# EAGLE design template_esp32 (EAGLE 9.6.2)

## Sheet 1 of 2
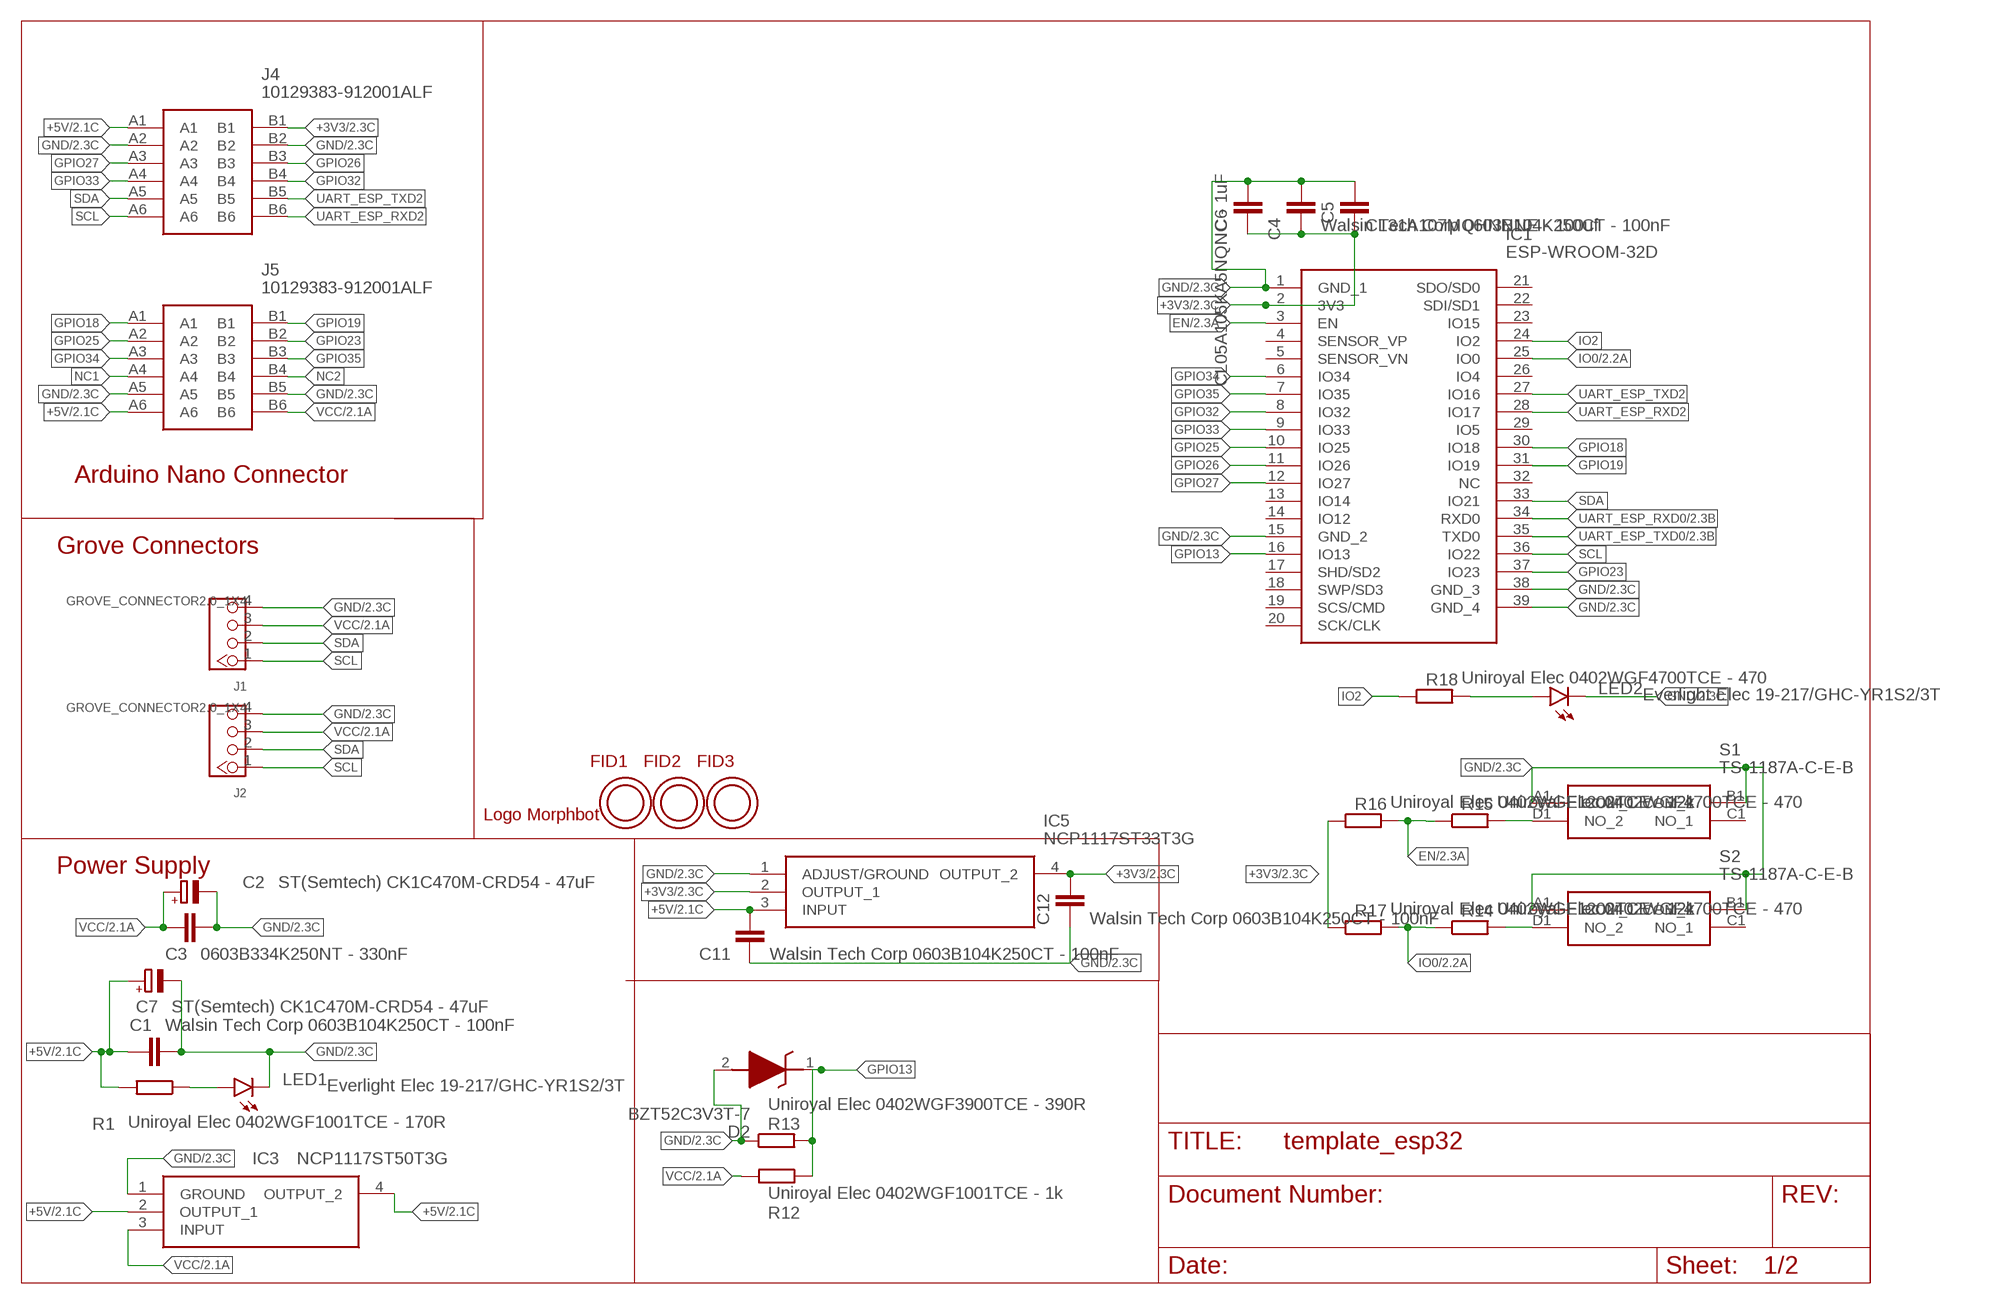
[diagram p0: schematic, sheet 1]

### Parts
C1  Walsin Tech Corp 0603B104K250CT - 100nF  C-EUC0603  [C0603]
C2  ST(Semtech) CK1C470M-CRD54 - 47uF  CPOL-EUC  [PANASONIC_C]
C3  0603B334K250NT - 330nF  C-EUC0603  [C0603]
C4  Walsin Tech Corp 0603B104K250CT - 100nF  C-EUC0603  [C0603]
C5  CL31A107MQHNNNE - 100uf  C-EUC1206  [C1206]
C6  CL05A105KA5NQNC - 1uF  C-EUC0402  [C0402]
C7  ST(Semtech) CK1C470M-CRD54 - 47uF  CPOL-EUC  [PANASONIC_C]
C11  Walsin Tech Corp 0603B104K250CT - 100nF  C-EUC0603  [C0603]
C12  Walsin Tech Corp 0603B104K250CT - 100nF  C-EUC0603  [C0603]
D2  BZT52C3V3T-7  [SODFL1608X65N]
FID1  OPEN-PNP-FIDUCIAL  [OPEN-PNP-FIDUCIAL]
FID2  OPEN-PNP-FIDUCIAL  [OPEN-PNP-FIDUCIAL]
FID3  OPEN-PNP-FIDUCIAL  [OPEN-PNP-FIDUCIAL]
IC1  ESP-WROOM-32D  [ESPWROOM32D]
IC3  NCP1117ST50T3G  [SOT230P700X180-4N]
IC5  NCP1117ST33T3G  [SOT230P700X180-4N]
J1  GROVE_CONNECTOR2.0_1X4  [2.0_1X4_STRAIGHT]
J2  GROVE_CONNECTOR2.0_1X4  [2.0_1X4_STRAIGHT]
J4  10129383-912001ALF  [10129383912001ALF]
J5  10129383-912001ALF  [10129383912001ALF]
LED1  Everlight Elec 19-217/GHC-YR1S2/3T  LEDCHIPLED_0603  [CHIPLED_0603]
LED2  Everlight Elec 19-217/GHC-YR1S2/3T  LEDCHIPLED_0603  [CHIPLED_0603]
R1  Uniroyal Elec 0402WGF1001TCE - 170R  R-EU_R0402  [R0402]
R12  Uniroyal Elec 0402WGF1001TCE - 1k  R-EU_R0402  [R0402]
R13  Uniroyal Elec 0402WGF3900TCE - 390R  R-EU_R0402  [R0402]
R14  Uniroyal Elec 0402WGF4700TCE - 470  R-EU_R0402  [R0402]
R15  Uniroyal Elec 0402WGF4700TCE - 470  R-EU_R0402  [R0402]
R16  Uniroyal Elec 0402WGF1202TCE - 12k  R-EU_R0402  [R0402]
R17  Uniroyal Elec 0402WGF1202TCE - 12k  R-EU_R0402  [R0402]
R18  Uniroyal Elec 0402WGF4700TCE - 470  R-EU_R0402  [R0402]
S1  TS-1187A-C-E-B  [TS1187ACEB]
S2  TS-1187A-C-E-B  [TS1187ACEB]
U$1  LOGO_MORPHBOT3MM  [LOGO_MOPRHBOT_3MM]

### Nets
+3V3: C4.1 C5.2 C6.1 C12.2 IC1.2(3V3) IC5.2(OUTPUT_1) IC5.4(OUTPUT_2) J4.B1 R16.1 R17.1 ; also sheet 2
+5V: C1.1 C7.+ C11.2 IC3.2(OUTPUT_1) IC3.4(OUTPUT_2) IC5.3(INPUT) J4.A1 J5.A6 R1.2 ; also sheet 2
EN: IC1.3(EN) R15.1 R16.2 ; also sheet 2
GND: C1.2 C2.- C3.1 C4.2 C5.1 C6.2 C7.- C11.1 C12.1 D2.2(A) IC1.1(GND_1) IC1.15(GND_2) IC1.38(GND_3) IC1.39(GND_4) IC3.1(GROUND) IC5.1(ADJUST/GROUND) J1.4 J2.4 J4.A2 J4.B2 J5.A5 J5.B5 LED1.C LED2.C R13.1 S1.A1(COM_1) S1.B1(COM_2) S2.A1(COM_1) S2.B1(COM_2) ; also sheet 2
GPIO13: D2.1(K) IC1.16(IO13) R12.1 R13.2
GPIO18: IC1.30(IO18) J5.A1
GPIO19: IC1.31(IO19) J5.B1
GPIO23: IC1.37(IO23) J5.B2
GPIO25: IC1.10(IO25) J5.A2
GPIO26: IC1.11(IO26) J4.B3
GPIO27: IC1.12(IO27) J4.A3
GPIO32: IC1.8(IO32) J4.B4
GPIO33: IC1.9(IO33) J4.A4
GPIO34: IC1.6(IO34) J5.A3
GPIO35: IC1.7(IO35) J5.B3
IO0: IC1.25(IO0) R14.1 R17.2 ; also sheet 2
IO2: IC1.24(IO2) R18.1
N$1: LED1.A R1.1
N$10: R15.2 S1.D1(NO_2)
N$11: R14.2 S2.D1(NO_2)
N$12: LED2.A R18.2
NC1: J5.A4
NC2: J5.B4
SCL: IC1.36(IO22) J1.1 J2.1 J4.A6
SDA: IC1.33(IO21) J1.2 J2.2 J4.A5
UART_ESP_RXD0: IC1.34(RXD0) ; also sheet 2
UART_ESP_RXD2: IC1.28(IO17) J4.B6
UART_ESP_TXD0: IC1.35(TXD0) ; also sheet 2
UART_ESP_TXD2: IC1.27(IO16) J4.B5
VCC: C2.+ C3.2 IC3.3(INPUT) J1.3 J2.3 J5.B6 R12.2 ; also sheet 2
Unconnected: IC1.4(SENSOR_VP) IC1.5(SENSOR_VN) IC1.13(IO14) IC1.14(IO12) IC1.17(SHD/SD2) IC1.18(SWP/SD3) IC1.19(SCS/CMD) IC1.20(SCK/CLK) IC1.21(SDO/SD0) IC1.22(SDI/SD1) IC1.23(IO15) IC1.26(IO4) IC1.29(IO5) IC1.32(NC) S1.C1(NO_1) S2.C1(NO_1)

### Notes on the sheet
- Arduino Nano Connector
- Grove Connectors
- Power Supply

## Sheet 2 of 2
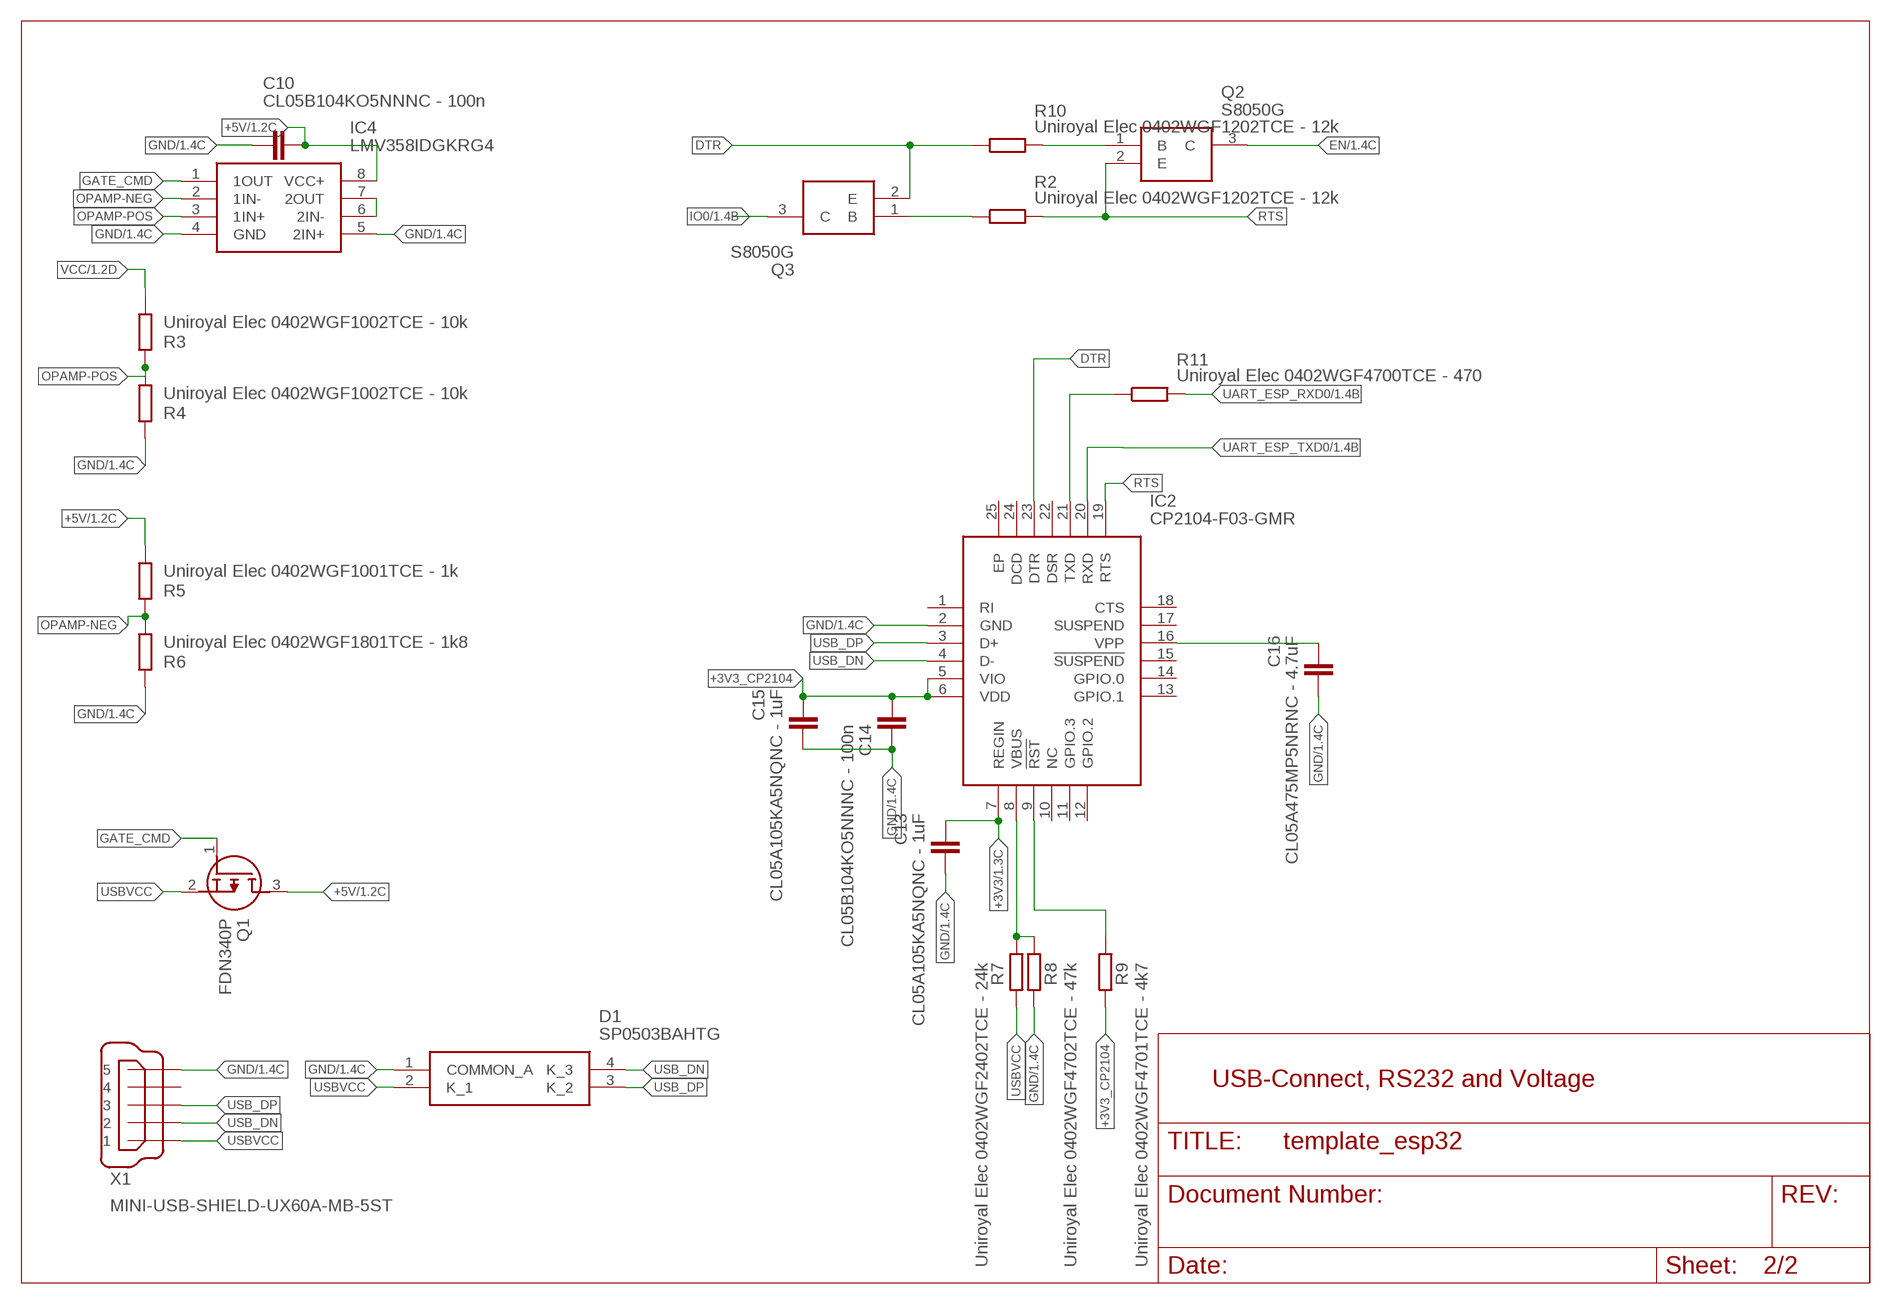
[diagram p1: schematic, sheet 2]

### Parts
C10  CL05B104KO5NNNC - 100n  C-EUC0402  [C0402]
C13  CL05A105KA5NQNC - 1uF  C-EUC0402  [C0402]
C14  CL05B104KO5NNNC - 100n  C-EUC0402  [C0402]
C15  CL05A105KA5NQNC - 1uF  C-EUC0402  [C0402]
C16  CL05A475MP5NRNC - 4.7uF  C-EUC0402  [C0402]
D1  SP0503BAHTG  [SP0503BAHTG]
IC2  CP2104-F03-GMR  [QFN50P400X400X80-25N]
IC4  LMV358IDGKRG4  [SOP65P490X110-8N]
Q1  FDN340P  [SOT95P237X112-3N]
Q2  S8050G  [SOT95P240X110-3N]
Q3  S8050G  [SOT95P240X110-3N]
R2  Uniroyal Elec 0402WGF1202TCE - 12k  R-EU_R0402  [R0402]
R3  Uniroyal Elec 0402WGF1002TCE - 10k  R-EU_R0402  [R0402]
R4  Uniroyal Elec 0402WGF1002TCE - 10k  R-EU_R0402  [R0402]
R5  Uniroyal Elec 0402WGF1001TCE - 1k  R-EU_R0402  [R0402]
R6  Uniroyal Elec 0402WGF1801TCE - 1k8  R-EU_R0402  [R0402]
R7  Uniroyal Elec 0402WGF2402TCE - 24k  R-EU_R0402  [R0402]
R8  Uniroyal Elec 0402WGF4702TCE - 47k  R-EU_R0402  [R0402]
R9  Uniroyal Elec 0402WGF4701TCE - 4k7  R-EU_R0402  [R0402]
R10  Uniroyal Elec 0402WGF1202TCE - 12k  R-EU_R0402  [R0402]
R11  Uniroyal Elec 0402WGF4700TCE - 470  R-EU_R0402  [R0402]
X1  MINI-USB-SHIELD-UX60A-MB-5ST  [UX60A-MB-5ST]

### Nets
+3V3: C13.2 IC2.7(REGIN) ; also sheet 1
+3V3_CP2104: C14.2 C15.2 IC2.5(VIO) IC2.6(VDD) R9.2
+5V: C10.2 IC4.8(VCC+) Q1.3(D) R5.1 ; also sheet 1
DTR: IC2.23(DTR) Q3.2(E) R10.1
EN: Q2.3(C) ; also sheet 1
GATE_CMD: IC4.1(1OUT) Q1.1(G)
GND: C10.1 C13.1 C14.1 C15.1 C16.1 D1.1(COMMON_A) IC2.2(GND) IC4.4(GND) IC4.5(2IN+) R4.2 R6.2 R8.2 X1.5 ; also sheet 1
IO0: Q3.3(C) ; also sheet 1
N$3: Q3.1(B) R2.1
N$4: IC4.6(2IN-) IC4.7(2OUT)
N$5: IC2.8(VBUS) R7.1 R8.1
N$6: IC2.9(!RST) R9.1
N$7: C16.2 IC2.16(VPP)
N$8: IC2.21(TXD) R11.1
N$9: Q2.1(B) R10.2
OPAMP-NEG: IC4.2(1IN-) R5.2 R6.1
OPAMP-POS: IC4.3(1IN+) R3.2 R4.1
RTS: IC2.19(RTS) Q2.2(E) R2.2
UART_ESP_RXD0: R11.2 ; also sheet 1
UART_ESP_TXD0: IC2.20(RXD) ; also sheet 1
USB_DN: D1.4(K_3) IC2.4(D-) X1.2
USB_DP: D1.3(K_2) IC2.3(D+) X1.3
USBVCC: D1.2(K_1) Q1.2(S) R7.2 X1.1
VCC: R3.1 ; also sheet 1
Unconnected: IC2.1(RI) IC2.10(NC) IC2.11(GPIO.3) IC2.12(GPIO.2) IC2.13(GPIO.1) IC2.14(GPIO.0) IC2.15(!SUSPEND) IC2.17(SUSPEND) IC2.18(CTS) IC2.22(DSR) IC2.24(DCD) IC2.25(EP) X1.4 X1.M1(S1) X1.M2(S2) X1.M3(S3) X1.M4(S4)

### Notes on the sheet
- USB-Connect, RS232 and Voltage

## Library data of the parts
C1 C3-C6 C10-C16 = rcl:C-EU: CAPACITOR, European symbol; SPICEPREFIX: C
C2 C7 = rcl:CPOL-EU: POLARIZED CAPACITOR, European symbol; SPICEPREFIX: C
D1 = samacsys:SP0503BAHTG: ESD Suppressors / TVS Diodes TVS AVAL DIODE SMT Source: Datasheet <https://nl.mouser.com/datasheet/2/240/Littelfuse_TVS_Diode_Array_SP05_Datasheet.pdf-777043.pdf>; ARROW_PART_NUMBER: SP0503BAHTG; ARROW_PRICE-STOCK: https://www.arrow.com/en/products/sp0503bahtg/littelfuse; DESCRIPTION: ESD Suppressors / TVS Diodes TVS AVAL DIODE SMT; HEIGHT: 1.22mm; MANUFACTURER_NAME: LITTELFUSE; MANUFACTURER_PART_NUMBER: SP0503BAHTG; MOUSER_PART_NUMBER: 576-SP0503BAHTG; MOUSER_PRICE-STOCK: https://www.mouser.co.uk/ProductDetail/Littelfuse/SP0503BAHTG?qs=uD%2FdkN7XIa0NTYXwHdELYA%3D%3D
D2 = samacsys:BZT52C3V3T-7: Diodes Inc BZT52C3V3T-7 Zener Diode, 3.3V 6% 300 mW SMT 2-Pin SOD-523 Source: Datasheet <http://docs-emea.rs-online.com/webdocs/1325/0900766b81325340.pdf>; ARROW_PART_NUMBER: BZT52C3V3T-7; ARROW_PRICE-STOCK: https://www.arrow.com/en/products/bzt52c3v3t-7/diodes-incorporated; DESCRIPTION: Diodes Inc BZT52C3V3T-7 Zener Diode, 3.3V 6% 300 mW SMT 2-Pin SOD-523; HEIGHT: 0.65mm; MANUFACTURER_NAME: Diodes Inc.; MANUFACTURER_PART_NUMBER: BZT52C3V3T-7; MOUSER_PART_NUMBER: 621-BZT52C3V3T-7; MOUSER_PRICE-STOCK: https://www.mouser.co.uk/ProductDetail/Diodes-Incorporated/BZT52C3V3T-7?qs=zLeapIUCO8SeTE43ANZQdw%3D%3D
FID1-FID3 = topo-eng:OPEN-PNP-FIDUCIAL
IC1 = samacsys:ESP-WROOM-32D: WiFi Modules (802.11) ESP32-D0WD 32 Mbits, 3.3 V 40 MHz onboard antenna (18.00+/-0.10) x (25.50+/-0.10) x (3.10+/-0.10) Source: Datasheet <https://componentsearchengine.com/Datasheets/1/ESP-WROOM-32D.pdf>; DESCRIPTION: WiFi Modules (802.11) ESP32-D0WD 32 Mbits, 3.3 V 40 MHz onboard antenna (18.00+/-0.10) x (25.50+/-0.10) x (3.10+/-0.10); HEIGHT: 3.2mm; MANUFACTURER_NAME: Espressif Systems; MANUFACTURER_PART_NUMBER: ESP-WROOM-32D; MOUSER_PART_NUMBER: 356-ESP-WROOM-32D; MOUSER_PRICE-STOCK: https://www.mouser.com/Search/Refine.aspx?Keyword=356-ESP-WROOM-32D
IC2 = samacsys:CP2104-F03-GMR: USB-to-UART 1-CH 576byte FIFO 3.3V Automotive 24-Pin QFN EP T/R Source: Datasheet <https://www.silabs.com/documents/public/data-sheets/cp2104.pdf>; ARROW_PART_NUMBER: CP2104-F03-GMR; ARROW_PRICE-STOCK: https://www.arrow.com/en/products/cp2104-f03-gmr/silicon-labs; DESCRIPTION: USB-to-UART 1-CH 576byte FIFO 3.3V Automotive 24-Pin QFN EP T/R; HEIGHT: 0.8mm; MANUFACTURER_NAME: Silicon Labs; MANUFACTURER_PART_NUMBER: CP2104-F03-GMR; MOUSER_PART_NUMBER: 634-CP2104-F03-GMR; MOUSER_PRICE-STOCK: https://www.mouser.co.uk/ProductDetail/Silicon-Labs/CP2104-F03-GMR?qs=1CB38rTTsYrRJKVkczeRzA%3D%3D
IC3 = samacsys:NCP1117ST50T3G: ON SEMICONDUCTOR - NCP1117ST50T3G - LDO, REG, 20VIN, 1A, 5V, 1%, SOT223-3 Source: Datasheet <http://www.onsemi.com/pub/Collateral/NCP1117-D.PDF>; ARROW_PART_NUMBER: NCP1117ST50T3G; ARROW_PRICE-STOCK: https://www.arrow.com/en/products/ncp1117st50t3g/on-semiconductor; DESCRIPTION: ON SEMICONDUCTOR - NCP1117ST50T3G - LDO, REG, 20VIN, 1A, 5V, 1%, SOT223-3; HEIGHT: 1.8mm; MANUFACTURER_NAME: ON Semiconductor; MANUFACTURER_PART_NUMBER: NCP1117ST50T3G; MOUSER_PART_NUMBER: 863-NCP1117ST50T3G; MOUSER_PRICE-STOCK: https://www.mouser.co.uk/ProductDetail/ON-Semiconductor/NCP1117ST50T3G?qs=Gev%252BmEvV0ib6dijy6U0dhQ%3D%3D
IC4 = samacsys:LMV358IDGKRG4: Operational Amplifiers - Op Amps Dual Low-Voltage Rail-to-Rail Out Source: Datasheet <http://www.ti.com/lit/ds/symlink/lmv358.pdf>; ARROW_PART_NUMBER: LMV358IDGKRG4; ARROW_PRICE-STOCK: https://www.arrow.com/en/products/lmv358idgkrg4/texas-instruments; DESCRIPTION: Operational Amplifiers - Op Amps Dual Low-Voltage Rail-to-Rail Out; HEIGHT: 1.1mm; MANUFACTURER_NAME: Texas Instruments; MANUFACTURER_PART_NUMBER: LMV358IDGKRG4; MOUSER_PART_NUMBER: 595-LMV358IDGKRG4; MOUSER_PRICE-STOCK: https://www.mouser.co.uk/ProductDetail/Texas-Instruments/LMV358IDGKRG4?qs=paYhMW8qfiuzqo4cLPZoVQ%3D%3D
IC5 = samacsys:NCP1117ST33T3G: ON SEMICONDUCTOR - NCP1117ST33T3G - IC, LINEAR VOLTAGE REGULATOR Source: Datasheet <http://www.onsemi.com/pub/Collateral/NCP1117-D.PDF>; ARROW_PART_NUMBER: NCP1117ST33T3G; ARROW_PRICE-STOCK: https://www.arrow.com/en/products/ncp1117st33t3g/on-semiconductor; DESCRIPTION: ON SEMICONDUCTOR - NCP1117ST33T3G - IC, LINEAR VOLTAGE REGULATOR; HEIGHT: 1.8mm; MANUFACTURER_NAME: ON Semiconductor; MANUFACTURER_PART_NUMBER: NCP1117ST33T3G; MOUSER_PART_NUMBER: 863-NCP1117ST33T3G; MOUSER_PRICE-STOCK: https://www.mouser.co.uk/ProductDetail/ON-Semiconductor/NCP1117ST33T3G?qs=Gev%252BmEvV0iZb%2FE8ahUDx3w%3D%3D
J1 J2 = morphbot:GROVE_CONNECTOR: Seeedstudio Grove-Connector: 1 = SCL 2 = SDA 3 = VCC 4 = GND
J4 J5 = samacsys:10129383-912001ALF: EconoStik, Board to Board connector, Unshrouded Vertical Header, Surface Mount, Double Row, Positions, 2.54 mm (0.100in) Pitch. Source: Datasheet <https://componentsearchengine.com/Datasheets/1/10129383-912001ALF.pdf>; DESCRIPTION: EconoStik, Board to Board connector, Unshrouded Vertical Header, Surface Mount, Double Row, Positions, 2.54 mm (0.100in) Pitch.; HEIGHT: 8.58mm; MANUFACTURER_NAME: Amphenol; MANUFACTURER_PART_NUMBER: 10129383-912001ALF; MOUSER_PART_NUMBER: 649-1012938391201ALF; MOUSER_PRICE-STOCK: https://www.mouser.co.uk/ProductDetail/Amphenol-FCI/10129383-912001ALF?qs=0lQeLiL1qyZD4F7peRNLhQ%3D%3D
LED1 LED2 = led:LED: LED OSRAM: - CHIPLED LG R971, LG N971, LY N971, LG Q971, LY Q971, LO R971, LY R971 LH N974, LH R974 LS Q976, LO Q976, LY Q976 LO Q996 - Hyper CHIPLED LW Q18S LB Q993, LB Q99A, LB R99A - SideLED LS A670, LO A670, LY A670, LG A670, LP A670 LB A673, LV A673, LT A673, LW A673 LH A674 LY A675 LS A676, LA A676, LO A676, LY A676, LW A676 LS A679, LY A679, LG A679 - Hyper Micro SIDELED® LS Y876, LA Y876, LO Y876, LY Y876 LT Y87S - SmartLED LW L88C, LW L88S LB L89C, LB L89S, LG L890 LS L89K, LO L89K, LY L89K LS L896, LA L896, LO L896, LY L896 - TOPLED LS T670, LO T670, LY T670, LG T670, LP T670 LSG T670, LSP T670, LSY T670, LOP T670, LYG T670 LG T671, LOG T671, LSG T671 LB T673, LV T673, LT T673, LW T673 LH T674 LS T676, LA T676, LO T676, LY T676, LB T676, LH T676, LSB T676, LW T676 LB T67C, LV T67C, LT T67C, LS T67K, LO T67K, LY T67K, LW E67C LS E67B, LA E67B, LO E67B, LY E67B, LB E67C, LV E67C, LT E67C LW T67C LS T679, LY T679, LG T679 LS T770, LO T770, LY T770, LG T770, LP T770 LB T773, LV T773, LT T773, LW T773 LH T774 LS E675, LA E675, LY E675, LS T675 LS T776, LA T776, LO T776, LY T776, LB T776 LHGB T686 LT T68C, LB T68C - Hyper Mini TOPLED® LB M676 - Mini TOPLED Santana® LG M470 LS M47K, LO M47K, LY M47K Source: http://www.osram.convergy.de LUXEON: - LUMILED® LXK2-PW12-R00, LXK2-PW12-S00, LXK2-PW14-U00, LXK2-PW14-V00 LXK2-PM12-R00, LXK2-PM12-S00, LXK2-PM14-U00 LXK2-PE12-Q00, LXK2-PE12-R00, LXK2-PE12-S00, LXK2-PE14-T00, LXK2-PE14-U00 LXK2-PB12-K00, LXK2-PB12-L00, LXK2-PB12-M00, LXK2-PB14-N00, LXK2-PB14-P00, LXK2-PB14-Q00 LXK2-PR12-L00, LXK2-PR12-M00, LXK2-PR14-Q00, LXK2-PR14-R00 LXK2-PD12-Q00, LXK2-PD12-R00, LXK2-PD12-S00 LXK2-PH12-R00, LXK2-PH12-S00 LXK2-PL12-P00, LXK2-PL12-Q00, LXK2-PL12-R00 Source: www.luxeon.com KINGBRIGHT: KA-3528ASYC Source: www.kingbright.com
Q1 = samacsys:FDN340P: Trans MOSFET P-CH 20V 2A 3-Pin SuperSOT Source: Datasheet <https://www.onsemi.com/pub/Collateral/FDN340P-D.PDF>; ARROW_PART_NUMBER: FDN340P; ARROW_PRICE-STOCK: https://www.arrow.com/en/products/fdn340p/on-semiconductor; DESCRIPTION: Trans MOSFET P-CH 20V 2A 3-Pin SuperSOT; HEIGHT: 1.12mm; MANUFACTURER_NAME: ON Semiconductor; MANUFACTURER_PART_NUMBER: FDN340P; MOUSER_PART_NUMBER: 512-FDN340P; MOUSER_PRICE-STOCK: https://www.mouser.co.uk/ProductDetail/ON-Semiconductor-Fairchild/FDN340P?qs=AMp2PTjoga9dhzFXRaqTZw%3D%3D
Q2 Q3 = samacsys:S8050G: Silicon Epitaxial Planar Transistor Source: Datasheet <http://www.gmesemi.com/KUpload/product/TR/S8050 SOT-23.pdf>; DESCRIPTION: Silicon Epitaxial Planar Transistor; HEIGHT: 1.1mm; MANUFACTURER_NAME: Galaxy; MANUFACTURER_PART_NUMBER: S8050G
R1-R18 = rcl:R-EU_: RESISTOR, European symbol; SPICEPREFIX: R
S1 S2 = samacsys:TS-1187A-C-E-B: SPST 50mA @ 12VDC 5.10mm x 5.10mm SMD Tactile Switches RoHS Source: Datasheet <https://datasheet.lcsc.com/szlcsc/XKB-TS-1187A-C-E-A_C318887.pdf>; DESCRIPTION: SPST 50mA @ 12VDC 5.10mm x 5.10mm SMD Tactile Switches RoHS; HEIGHT: 1.65mm; MANUFACTURER_NAME: XKB Enterprise; MANUFACTURER_PART_NUMBER: TS-1187A-C-E-B
U$1 = topo-eng:LOGO_MORPHBOT
X1 = con-hirose:MINI-USB-SHIELD-: MINI USB Connector Source: http://www.hirose.co.jp/cataloge_hp/e24000019.pdf; OC_FARNELL: unknown; OC_NEWARK: unknown

## Board
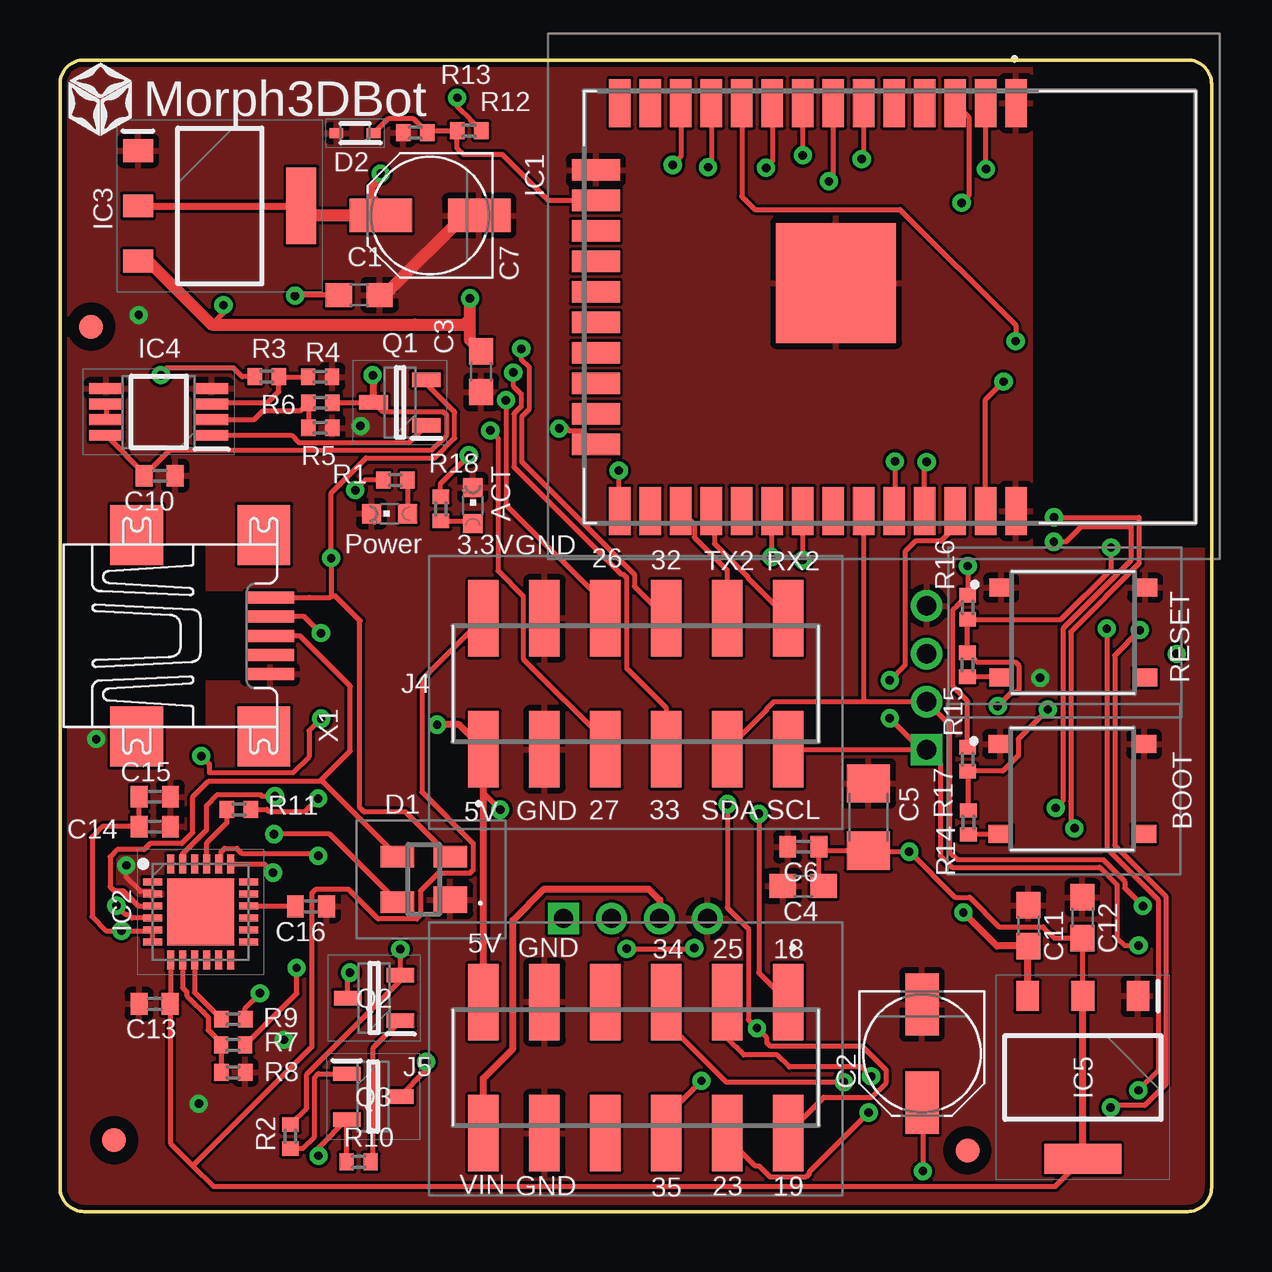
[diagram p2: board, top side]
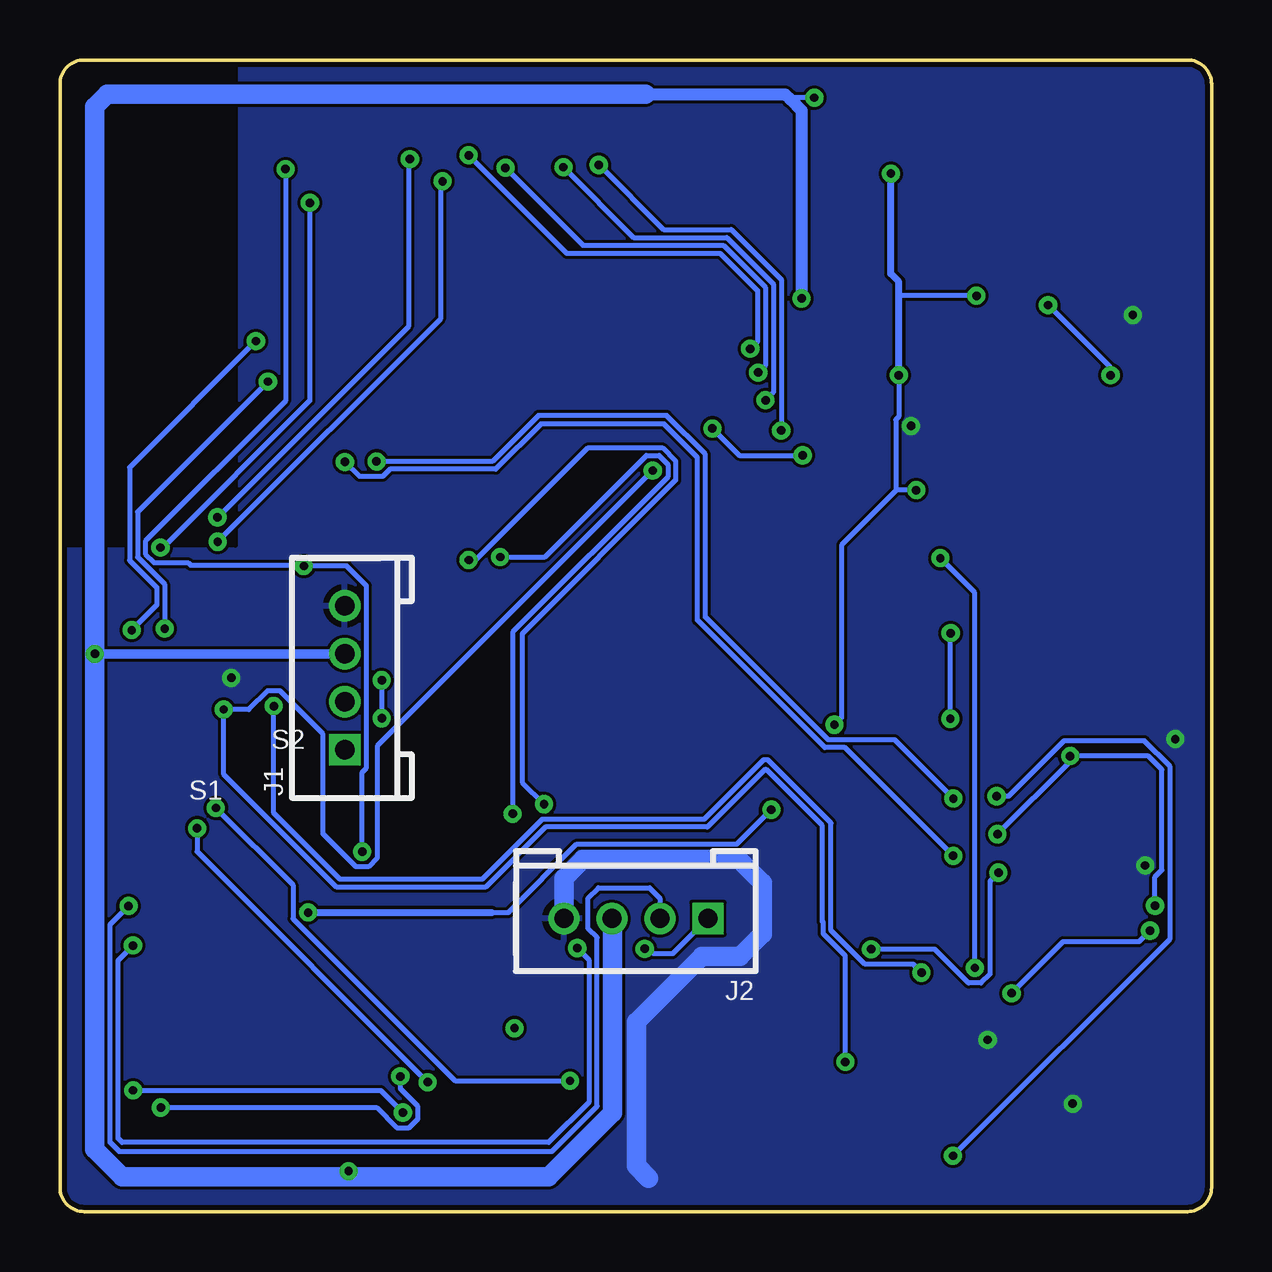
[diagram p3: board, bottom side, seen from below]

Size 48 x 48 mm. Coordinates in mm from the lower left corner, seen from the top.
Outline: 47,0 1,0 arc-90 0,1 0,47 arc-90 1,48 47,48 arc-90 48,47 48,1 arc-90 47,0
Copper layers (1*16): Top 0.035mm / dielectric 0.2mm / Bottom 0.035mm
Design rules "jlcpcb_4_layer *": minimum track width 3.5mil, minimum drill 0.2mm, track to track 5mil, track to pad 6mil, pad to pad 6mil, via to via 6mil, smd to smd 6mil, copper to edge 0.2mm, drill to drill 6mil, minimum pad ring 10mil, minimum via ring 8mil, stop-mask expansion 4mil, vias tented up to drill 0mil, thermal gap 10mil
bKeepout: area 24,0 to 48,48; area 0,0 to 24,48

### Footprints (pad centres in the part's own frame; a part is rotated, then mirrored left to right if it is on the bottom)
C0603 = smd 1.1 x 1: 1 -0.85,0; 2 0.85,0
PANASONIC_C = smd 2.6 x 1.4: + 2.05,0; - -2.05,0
C1206 = smd 1.6 x 1.8: 1 -1.4,0; 2 1.4,0
C0402 = smd 0.7 x 0.9: 1 -0.65,0; 2 0.65,0
SP0503BAHTG = smd 1.1 x 1.4: 1 -0.85,-1.1 | smd 0.9 x 1.4: 2 0.95,-1.1; 3 0.95,1.1; 4 -0.95,1.1
SODFL1608X65N = smd 0.57 x 0.42: 1 -0.775,0; 2 0.775,0
OPEN-PNP-FIDUCIAL = smd 1 x 1: FID$1 0,0
ESPWROOM32D = smd 2 x 0.9: 1 -8.5,5.26; 2 -8.5,3.99; 3 -8.5,2.72; 4 -8.5,1.45; 5 -8.5,0.18; 6 -8.5,-1.09; 7 -8.5,-2.36; 8 -8.5,-3.63; 9 -8.5,-4.9; 10 -8.5,-6.17; 11 -8.5,-7.44; 12 -8.5,-8.71; 13 -8.5,-9.98; 14 -8.5,-11.25; 25 8.5,-11.25; 26 8.5,-9.98; 27 8.5,-8.71; 28 8.5,-7.44; 29 8.5,-6.17; 30 8.5,-4.9; 31 8.5,-3.63; 32 8.5,-2.36; 33 8.5,-1.09; 34 8.5,0.18; 35 8.5,1.45; 36 8.5,2.72; 37 8.5,3.99; 38 8.5,5.26 | smd 0.9 x 2: 15 -5.715,-12.25; 16 -4.445,-12.25; 17 -3.175,-12.25; 18 -1.905,-12.25; 19 -0.635,-12.25; 20 0.635,-12.25; 21 1.905,-12.25; 22 3.175,-12.25; 23 4.445,-12.25; 24 5.715,-12.25 | smd 5 x 5: 39 -1,-2.24
QFN50P400X400X80-25N = smd 0.8 x 0.3: 1 -2,1.25; 2 -2,0.75; 3 -2,0.25; 4 -2,-0.25; 5 -2,-0.75; 6 -2,-1.25; 13 2,-1.25; 14 2,-0.75; 15 2,-0.25; 16 2,0.25; 17 2,0.75; 18 2,1.25 | smd 0.3 x 0.8: 7 -1.25,-2; 8 -0.75,-2; 9 -0.25,-2; 10 0.25,-2; 11 0.75,-2; 12 1.25,-2; 19 1.25,2; 20 0.75,2; 21 0.25,2; 22 -0.25,2; 23 -0.75,2; 24 -1.25,2 | smd 2.8 x 2.8: 25 0,0
SOT230P700X180-4N = smd 1.25 x 0.95: 1 -3.4,2.3; 2 -3.4,0; 3 -3.4,-2.3 | smd 1.25 x 3.2: 4 3.4,0
SOP65P490X110-8N = smd 1.4 x 0.45: 1 -2.2,0.975; 2 -2.2,0.325; 3 -2.2,-0.325; 4 -2.2,-0.975; 5 2.2,-0.975; 6 2.2,-0.325; 7 2.2,0.325; 8 2.2,0.975
2.0_1X4_STRAIGHT = drill 0.8 pad 1.27 square: 1 1.83,-1.786 | drill 0.8 pad 1.27: 2 3.83,-1.786; 3 5.83,-1.786; 4 7.83,-1.786
10129383912001ALF = smd 1.27 x 3.18: A1 -6.35,-2.73; A2 -3.81,-2.73; A3 -1.27,-2.73; A4 1.27,-2.73; A5 3.81,-2.73; A6 6.35,-2.73; B1 -6.35,2.73; B2 -3.81,2.73; B3 -1.27,2.73; B4 1.27,2.73; B5 3.81,2.73; B6 6.35,2.73
CHIPLED_0603 = smd 0.8 x 0.8: A 0,-0.75; C 0,0.75
SOT95P237X112-3N = smd 1.2 x 0.6: 1 -1.1,0.95; 2 -1.1,-0.95; 3 1.1,0
SOT95P240X110-3N = smd 1.15 x 0.6: 1 -1.1,0.95; 2 -1.1,-0.95; 3 1.1,0
R0402 = smd 0.6 x 0.7: 1 -0.5,0; 2 0.5,0
TS1187ACEB = smd 1 x 0.75: A1 -3,1.875; B1 3,1.875; C1 3,-1.875; D1 -3,-1.875
UX60A-MB-5ST = smd 2 x 0.5: 1 2.25,1.6; 2 2.25,0.8; 3 2.25,0; 4 2.25,-0.8; 5 2.25,-1.6 | smd 2.2 x 2.5: M1 -3.3,-4.2; M2 -3.3,4.2; M3 2,4.2; M4 2,-4.2

### Placement (x,y rotation side)
C1  12.47,38.2 0 top
C2  35.93,6.59 270 top
C3  17.56,35 90 top
C4  30.98,13.57 180 top
C5  33.7,16.44 270 top
C6  30.99,15.21 180 top
C7  15.43,41.52 180 top
C10  4.15,30.67 180 top
C11  40.37,11.92 270 top
C12  42.62,12.25 270 top
C13  3.95,8.66 0 top
C14  3.96,16.05 180 top
C15  3.96,17.29 180 top
C16  10.46,12.72 180 top
D1  15.17,13.85 90 top
D2  12.3,44.95 180 top
FID1  2.25,2.97 0 top
FID2  37.83,2.54 0 top
FID3  1.3,36.88 0 top
IC1  34.59,37.7 270 top
IC2  5.86,12.49 0 top
IC3  6.66,41.92 0 top
IC4  4.12,33.33 180 top
IC5  42.64,5.59 270 top
J1  37.91,17.42 90 bottom
J2  19.16,10.43 180 bottom
J4  24,22 0 top
J5  24,6 180 top
LED1  13.74,29.09 90 top
LED2  17.21,29.43 0 top
Q1  14.17,33.72 180 top
Q2  13.09,8.9 180 top
Q3  13.06,4.79 0 top
R1  13.98,30.49 180 top
R2  9.6,3.13 90 top
R3  8.62,34.8 0 top
R4  10.84,34.79 0 top
R5  10.86,33.71 180 top
R6  10.85,32.66 0 top
R7  7.22,6.95 0 top
R8  7.22,5.8 0 top
R9  7.22,8.02 0 top
R10  12.45,2.07 0 top
R11  7.47,16.76 0 top
R12  17.06,45.05 0 top
R13  14.81,44.97 0 top
R14  37.87,16.22 270 top
R15  37.83,22.79 270 top
R16  37.83,25.18 270 top
R17  37.83,18.86 270 top
R18  15.87,29.29 270 top
S1  42.23,24.13 0 top
S2  42.19,17.61 0 top
U$1  0.37,44.85 0 top
X1  6.5,24 0 top

### Tracks (layer width: path | path; a pad name or v marks a point on that pad's centre or on a via)
+3V3  (via drill 0.35)
  Top 0.2: IC2.7 4.61,8.67 C13.2 4.6,2.85 5.54,1.91 | 5.54,1.91 6.4,1.05 41.5,1.05 IC5.4 | J4.B1 15.09,22.17 15.09,17.49 17.22,15.35 17.22,14.24 17.07,14.1 15.76,14.1 15.02,13.36 15.02,12.34 14.88,12.2 13.27,12.2 12.04,13.42 10.66,13.42 10.5,13.26 10.5,6.86 5.54,1.91 | IC5.2 42.62,9 C12.2 41.44,11.4 40.97,11.87 39.14,11.87 37.92,13.1 37.31,13.1 v35.4,15 33.74,15 C5.2 31.8,15.04 C6.1 31.64,13.76 C4.1 | v38.6,43.45 38.6,46.18 IC1.2 | R17.1 37.83,21.28 37.23,21.89 37.23,25.08 37.38,25.23 R16.1 v37.84,26.91
  Top 0.3: IC5.4 IC5.2
  Bottom 0.2: v35.4,15 35.4,18.31 35.22,18.49 35.22,26.08 36.05,26.91 v37.84,26.91 37.88,26.95 42.56,26.95 42.66,27.05 44.07,27.05 44.44,27.42 44.44,27.94 38.6,33.78 v38.6,43.45
+3V3_CP2104  (via drill 0.35)
  Top 0.2: IC2.6 3.86,11.71 | 3.86,11.71 IC2.5 | C15.2 C14.2 1.77,16.05 1.34,15.62 1.34,12.28 1.92,11.71 v2.56,11.71 3.86,11.71 | R9.2 7.72,8.49 v8.34,9.1
  Bottom 0.2: v8.34,9.1 6.18,11.26 3.01,11.26 v2.56,11.71
+5V  (via drill 0.35)
  Top 0.2: R5.1 Q1.3 13.47,33.33 15.98,33.33 16.13,33.18 16.13,32.37 15.49,31.73 4.57,31.73 C10.2 3.5,30.77 IC4.8 | C1.1 9.83,38.2 v9.8,38.17 | R1.2 12.73,30.49 v12.31,30.07 | v18.35,16.75 17.65,17.45 17.65,18.79
  Top 0.3: IC3.2 9.97,41.91 IC3.4 | Q1.3 13.07,34.52 13.04,34.55 v13.04,34.86 | J5.A6 17.65,18.79 J4.A1 16.63,20.29 v15.72,20.29 | C7.+ 13.38,41.95 12.99,42.34 12.99,42.7 13.37,43.07 v13.37,43.26 | IC5.3 40.34,11.04 C11.2 39.05,11.07 v37.66,12.47
  Top 0.5: C7.+ 13.1,41.52 10.37,41.52 9.97,41.91
  Bottom 0.2: v15.72,20.29 15.42,20.59 15.42,27.78 14.41,28.8 13.16,30.04 | v9.8,38.17 12.93,38.17 13.04,38.28 | v13.04,34.86 13.04,33.13 13.16,33.01 13.16,30.04 | v12.31,30.07 13.13,30.07 13.16,30.04 | v18.35,16.75 19.79,15.32 26.46,15.32 29.31,12.47 30.01,12.47
  Bottom 0.3: v13.04,34.86 13.04,38.28 13.04,38.76 13.37,39.08 v13.37,43.26 | v37.66,12.47 30.01,12.47
DTR  (via drill 0.35)
  Top 0.2: R10.1 Q3.2 10.77,2.66 v10.77,2.32 | v8.96,17.31 8.42,17.31 8.37,17.37 6.56,17.37 6.11,16.91 6.11,15.9 5.11,14.91 IC2.23
  Bottom 0.2: v8.96,17.31 8.46,17.31 6.15,19.62 2.8,19.62 1.73,18.54 1.73,11.37 v10.77,2.32
EN  (via drill 0.35)
  Top 0.2: Q2.3 11.99,9.86 v12.09,9.96 | v39.09,21.07 39.65,21.63 39.84,21.63 39.98,21.78 39.98,22.74 39.84,22.89 38.23,22.89 R15.1 R16.2 41.73,24.68 43.81,26.77 v43.81,27.68 | IC1.3 37.88,45.63 37.88,42.34 v37.59,42.05
  Bottom 0.2: v12.09,9.96 12.43,10.3 14.45,10.3 15.86,11.72 15.86,16.19 18.5,18.83 18.68,18.83 21.15,16.35 27.9,16.35 30.4,13.85 36.33,13.85 39.09,16.61 v39.09,21.07 | v37.59,42.05 37.59,33.79 43.7,27.68 v43.81,27.68
FREE
  cutout Bottom: 40.69,48.69 40.69,27.78 48.66,27.78 48.66,48.67
FREE_2
  cutout Top: 40.66,27.77 48.7,27.77 48.7,48.67 40.65,48.67
GATE_CMD
  Top 0.2: IC4.1 9.65,32.36 9.94,32.06 14.56,32.06 Q1.1
GND  (via drill 0.35)
  Top 0.2: IC2.2 3.77,13.34 3.36,13.34 2.76,13.93 v2.76,14.43
  Top 0.5: C7.- 16.86,41.52 13.75,38.41 13.27,38.41
  Bottom 0.813: 23.46,1.39 23.98,1.9 23.98,7.9 21.23,10.64 19.65,10.64 18.72,11.57 18.72,13.7 19.7,14.68 26.2,14.68 26.99,13.89 J2.4
  other vias: 12.53,32.75 5.79,4.49 40.86,22.24 3.28,37.37 9.33,7.16 1.51,19.69
  pour Bottom (rank 2): 1,0 arc-90 0,1 0,47 arc-90 1,48 47,48 arc-90 48,47 48,1 arc-90 47,0
  pour Top (rank 2): 1,0 arc-90 0,1 0,47 arc-90 1,48 47,48 arc-90 48,47 48,1 arc-90 47,0
GPIO13
  Top 0.2: D2.1 13.7,45.57 14.71,45.57 14.86,45.42 R13.2 15.39,45.05 R12.1 16.56,44.31 16.81,44.05 18.45,44.05 20.36,42.14 IC1.16
GPIO18  (via drill 0.35)
  Top 0.2: IC1.30 29.65,29.17 v29.65,27.28 | v29.13,16.58 29.13,9.95 J5.A1
  Bottom 0.2: v29.13,16.58 29.13,24.16 22.66,30.62 22.66,31.15 23.03,31.52 23.55,31.52 27.79,27.28 v29.65,27.28
GPIO19  (via drill 0.35)
  Top 0.2: IC1.31 v30.96,27.16 | v27.82,16.98 27.82,12.66 28.7,11.79 28.7,8 v29.05,7.64 29.46,7.23 29.46,7.04 29.61,6.89 33.45,6.89 34.44,5.89 34.44,5.37 33.83,4.76 31.84,4.76 J5.B1
  Bottom 0.2: v30.96,27.16 30.67,27.16 25.98,31.84 22.89,31.84 22.33,31.28 22.33,30.49 28.74,24.08 28.74,17.9 v27.82,16.98
GPIO23  (via drill 0.35)
  Top 0.2: v43.64,24.3 43.64,15.13 45.77,12.99 45.77,5.87 v44.95,5.05 | v33.71,4.12 31.24,1.65 31.24,1.57 31.09,1.43 29.61,1.43 29.15,1.89 29,1.89 27.81,3.08 J5.B2 | IC1.37 38.58,33.84 v39.33,34.59
  Bottom 0.2: v43.64,24.3 43.64,26.15 44.77,27.28 44.77,29.16 v39.33,34.59 | v44.95,5.05 34.63,5.05 v33.71,4.12
GPIO25  (via drill 0.35)
  Top 0.2: IC1.10 28.42,42.31 28.96,41.77 35.02,41.77 39.84,36.95 v39.84,36.28 | v45.01,24.23 43.96,23.19 43.96,15.26 46.1,13.13 46.1,5.31 45.21,4.42 43.88,4.42 v43.8,4.33 | v33.81,5.63 33.42,6.02 30.41,6.02 29.9,6.53 28.5,6.53 27.81,7.23 J5.A2
  Bottom 0.2: v39.84,36.28 45.1,31.02 45.1,27.14 43.96,26.01 43.96,25.28 v45.01,24.23 | v43.8,4.33 34.81,4.33 33.97,3.49 33.45,3.49 33.08,3.86 33.08,4.38 33.81,5.12 v33.81,5.63
GPIO26  (via drill 0.35)
  Top 0.2: IC1.11 27.15,43.66 v27.02,43.53 | J4.B3 22.73,25.31 18.59,29.45 v18.59,33.82
  Bottom 0.2: v27.02,43.53 24.09,40.6 20.21,40.6 18.26,38.66 18.26,34.15 v18.59,33.82
GPIO27  (via drill 0.35)
  Top 0.2: IC1.12 25.88,43.97 v25.54,43.63 | v17.93,32.56 18.25,32.24 18.25,26.71 19.3,25.66 19.3,23.04 22.73,19.61 J4.A3
  Bottom 0.2: v25.54,43.63 22.84,40.93 20.02,40.93 17.93,38.84 v17.93,32.56
GPIO32  (via drill 0.35)
  Top 0.2: IC1.8 v30.96,44.03 v30.96,44.02 | v19.23,35.96 19.23,35.53 19.55,35.21 19.55,33.42 19.24,33.12 19.24,31.26 23.94,26.56 23.94,26.06 J4.B4
  Bottom 0.2: v30.96,44.02 26.89,39.95 20.49,39.95 18.93,38.39 18.93,36.27 v19.23,35.96
GPIO33  (via drill 0.35)
  Top 0.2: IC1.9 29.69,43.76 v29.43,43.5 | v18.89,34.97 18.89,34.41 19.22,34.08 19.22,33.56 18.92,33.25 18.92,31.04 23.38,26.57 23.47,26.57 23.62,26.43 23.62,22.66 25.27,21.01 J4.A4
  Bottom 0.2: v29.43,43.5 26.2,40.27 20.35,40.27 18.6,38.52 18.6,35.27 v18.89,34.97
GPIO34  (via drill 0.35)
  Top 0.2: IC1.6 33.5,43.95 v33.41,43.87 | v41.44,28.94 44.97,28.94 44.97,27 42.13,24.17 42.13,17.09 42.13,16.12 v42.28,15.97 | v32.67,5.39 27.77,5.39 25.27,7.9 J5.A3
  Bottom 0.2: v33.41,43.87 33.48,43.8 33.48,36.89 v41.44,28.94 | v42.28,15.97 42.28,15.01 v32.67,5.39
GPIO35  (via drill 0.35)
  Top 0.2: IC1.7 32.23,43.12 v32.05,42.94 | v41.51,16.82 41.81,17.13 41.81,24.3 44.64,27.14 44.64,28.55 42.57,28.55 41.94,27.92 v41.43,27.92 | v26.74,5.45 25.48,4.19 25.48,3.48 J5.B3
  Bottom 0.2: v32.05,42.94 32.14,42.85 32.14,37.21 v41.43,27.92 | v26.74,5.45 31.53,5.45 38.29,12.21 38.29,13.61 v41.51,16.82
IO0  (via drill 0.35)
  Top 0.2: R14.1 37.87,18.32 R17.2 39.29,18.36 39.94,19 39.94,19.69 v41.18,20.93 | Q3.3 15.26,5.9 v15.26,6.24 | IC1.25 23.29,29.25 v23.29,30.88
  Bottom 0.2: v15.26,6.24 15.26,10.66 16.19,11.58 16.19,12.05 16.22,12.09 16.22,16.09 18.56,18.42 18.62,18.42 21.02,16.02 27.76,16.02 30.27,13.52 36.47,13.52 41.18,18.23 v41.18,20.93 40.13,20.93 39.35,21.7 38.83,21.7 37.03,19.9 37.03,15.74 35.66,14.37 35.14,14.37 34.77,14.74 34.77,19.41 v23.29,30.88
IO2  (via drill 0.35)
  Top 0.2: R18.1 15.87,30.35 v17.05,31.52 | v20.81,32.64 21.14,32.64 21.23,32.55 21.77,32.55 IC1.24
  Bottom 0.2: v20.81,32.64 19.68,31.52 v17.05,31.52
N$1
  Top 0.2: R1.1 LED1.A
N$3
  Top 0.2: R2.1 10.12,2.63 10.61,3.12 10.61,5.58 10.77,5.74 Q3.1
N$4
  Top 0.2: IC4.6 IC4.7
N$5
  Top 0.2: IC2.8 5.11,9.33 5.29,9.15 5.29,9 6.17,8.11 6.17,7.57 6.72,7.02 R7.1 6.72,5.83 6.71,5.82 R8.1
N$6
  Top 0.2: IC2.9 5.61,9.13 R9.1
N$7
  Top 0.2: IC2.16 9.79,12.74 C16.2
N$8
  Top 0.2: IC2.21 6.11,15.36 6.96,16.21 R11.1
N$9
  Top 0.2: R10.2 13.05,2.17 13.05,6.81 Q2.1
N$10
  Top 0.2: S1.D1 39.2,22.29 R15.2
N$11
  Top 0.2: S2.D1 39.17,15.72 R14.2
N$12
  Top 0.2: R18.2 17.1,28.79 LED2.A
OPAMP-NEG
  Top 0.2: R6.1 10.36,32.67 R5.2 10.03,33.38 8.47,33.38 8.09,33.01 IC4.2
OPAMP-POS
  Top 0.2: IC4.3 6.37,33.71 8.66,33.71 9.12,34.17 R3.2 R4.1
RTS  (via drill 0.35)
  Top 0.2: R2.2 10.28,4.31 10.28,5.72 14.19,9.63 Q2.2 v14.19,10.93 | IC2.19 8.51,14.49 v8.88,14.12
  Bottom 0.2: v8.88,14.12 9.23,13.77 9.23,9.89 9.6,9.53 10.13,9.53 11.54,10.93 v14.19,10.93
SCL  (via drill 0.35)
  Top 0.2: v26.44,10.98 26.43,10.95 v23.63,10.95 | 35.99,19.25 J1.1 36.7,18.68 36.7,14.83 37.18,14.35 43.33,14.35 44.06,13.62 44.06,11.41 44.38,11.09 v44.96,11.09 | 35.99,19.25 30.37,19.25 J4.A6 | v34.59,22.15 35.22,22.78 35.22,27.5 35.67,27.95 36.72,27.95 37.31,28.53 IC1.36 | v34.59,20.56 35.9,19.25 35.99,19.25
  Bottom 0.2: J2.1 22.46,10.74 23.26,10.74 v23.63,10.95 | v26.44,10.98 25.96,10.49 25.96,4.55 27.63,2.88 45.41,2.88 45.58,3.04 45.58,10.46 v44.96,11.09 | v34.59,22.15 v34.59,20.56
SDA  (via drill 0.35)
  Top 0.2: J4.A5 29.46,20.92 29.46,20.96 29.75,21.25 33.59,21.25 | 33.59,21.25 J1.2 37.08,20.3 37.08,15 37.41,14.67 43.47,14.67 44.38,13.76 44.38,13.49 v45.14,12.73 | IC1.33 33.5,21.34 33.59,21.25
  Bottom 0.2: J2.2 22.99,13.06 23.43,13.49 25.55,13.49 25.98,13.07 25.98,11.79 25.61,11.42 25.61,4.39 27.5,2.51 45.54,2.51 45.91,2.88 45.91,11.96 v45.14,12.73
UART_ESP_RXD0  (via drill 0.35)
  Top 0.2: R11.2 8.62,16.76 8.7,16.68 10.23,16.68 v10.76,17.21 | v34.81,31.27 34.81,29.24 IC1.34
  Bottom 0.2: v10.76,17.21 13.21,19.66 15.98,19.66 21.1,24.78 21.1,31.57 22.71,33.18 28.06,33.18 29.97,31.27 v34.81,31.27
UART_ESP_RXD2
  Top 0.2: IC1.28 27.28,29.07 27.28,27.84 28.7,26.43 28.7,26.38 J4.B6
UART_ESP_TXD0  (via drill 0.35)
  Top 0.2: IC1.35 36.04,31.16 v36.13,31.25 | IC2.20 6.71,14.59 6.71,14.99 6.86,15.14 7.37,15.14 7.58,14.93 10.66,14.93 v10.76,14.83
  Bottom 0.2: v10.76,14.83 15.27,19.33 16.11,19.33 21.43,24.65 21.43,31.44 22.82,32.83 27.95,32.83 29.84,30.94 34.24,30.94 34.55,30.64 35.52,30.64 v36.13,31.25
UART_ESP_TXD2
  Top 0.2: IC1.27 26.45,28.63 26.45,28.09 27.81,26.73 J4.B5
USB_DN  (via drill 0.35)
  Top 0.2: IC2.4 3,12.24 2.87,12.37 2.74,12.37 v2.36,12.75 | v5.89,18.99 6.22,18.66 6.22,18.29 9.73,18.29 10.38,18.95 10.38,20.04 v10.88,20.54 | D1.4 11.24,15.73 v8.92,15.73 | v10.87,24.11 10.18,24.8 X1.2
  Bottom 0.2: v2.36,12.75 2.36,13.94 2.07,14.23 2.07,18.42 2.63,18.99 v5.89,18.99 5.89,18.76 v8.92,15.73 | v10.88,20.54 10.88,24.1 v10.87,24.11
USB_DP
  Top 0.2: IC2.3 3.26,12.74 2.62,13.38 2.24,13.38 2.09,13.54 2.09,14.78 2.39,15.09 3.5,15.09 3.76,15.34 5.08,15.34 5.54,15.8 5.54,17.28 6.2,17.94 10.84,17.94 | D1.3 10.88,17.98 10.84,17.94 | X1.3 10.01,23.99 12.1,21.91 12.1,19.2 10.84,17.94
USBVCC  (via drill 0.35)
  Top 0.2: X1.1 10.4,25.6 11.27,25.6 11.34,25.66 | Q1.2 15.27,34.49 16.45,33.31 16.45,32.23 15.63,31.41 12.75,31.41 11.3,29.96 v11.3,27.23 11.3,25.7 11.34,25.66 | R7.2 9.87,9.09 v9.87,10.15 | D1.2 14.41,16.65 12.68,16.65 12.48,16.85 12.48,24.59 12.52,24.62 11.47,25.66 11.34,25.66
  Bottom 0.2: v9.87,10.15 9.87,25.8 v11.3,27.23
VCC  (via drill 0.35)
  Top 0.2: R3.1 7.6,34.8 7.24,35.17 4.43,35.17 4.21,34.95 v4.21,34.86 | v6.82,37.78 6.82,37.47 6.32,36.97 | C2.+ 35.97,4.5 v35.97,1.68 | R12.2 17.11,45.5 16.55,46.06 v16.55,46.43
  Top 0.3: J5.B6 17.65,5.56 18.88,6.79 18.88,12.14 20.19,13.45 24.54,13.45 24.99,12.99 J2.3
  Top 0.5: IC3.3 3.67,39.62 6.32,36.97 14.8,36.97 16.86,36.97 17.09,37.2 v17.09,38.06 17.09,36.32 C3.2
  Bottom 0.2: v4.21,34.86 4.21,35.2 v6.8,37.79 | v6.8,37.79 | v6.8,37.79 v6.82,37.78 | v35.97,1.68 35.97,1.49 36,1.45 | v16.55,46.43 17.49,46.43 17.56,46.35
  Bottom 0.4: J1.3 v46.54,23.25 v46.55,23.25
  Bottom 0.5: 24.97,12.2 J2.3 | 23.6,46.57 17.78,46.57 17.56,46.35 17.09,45.89 v17.09,38.06
  Bottom 0.813: 23.6,46.57 46.02,46.57 46.55,46.05 v46.55,23.25 46.55,2.59 45.4,1.45 36,1.45 27.64,1.45 24.97,4.12 24.97,12.2

### Text on the board
tNames: ACT | Power | 3.3V | GND | 26 | 32 | TX2 | RX2 | RESET | 5V | GND | 27 | 33 | SDA | SCL | BOOT | 5V | GND | 34 | 25 | 18 | VIN | GND | 35 | 23 | 19